# EAGLE design Untitled - halv-xs-V3.4 (EAGLE 9.0.0)
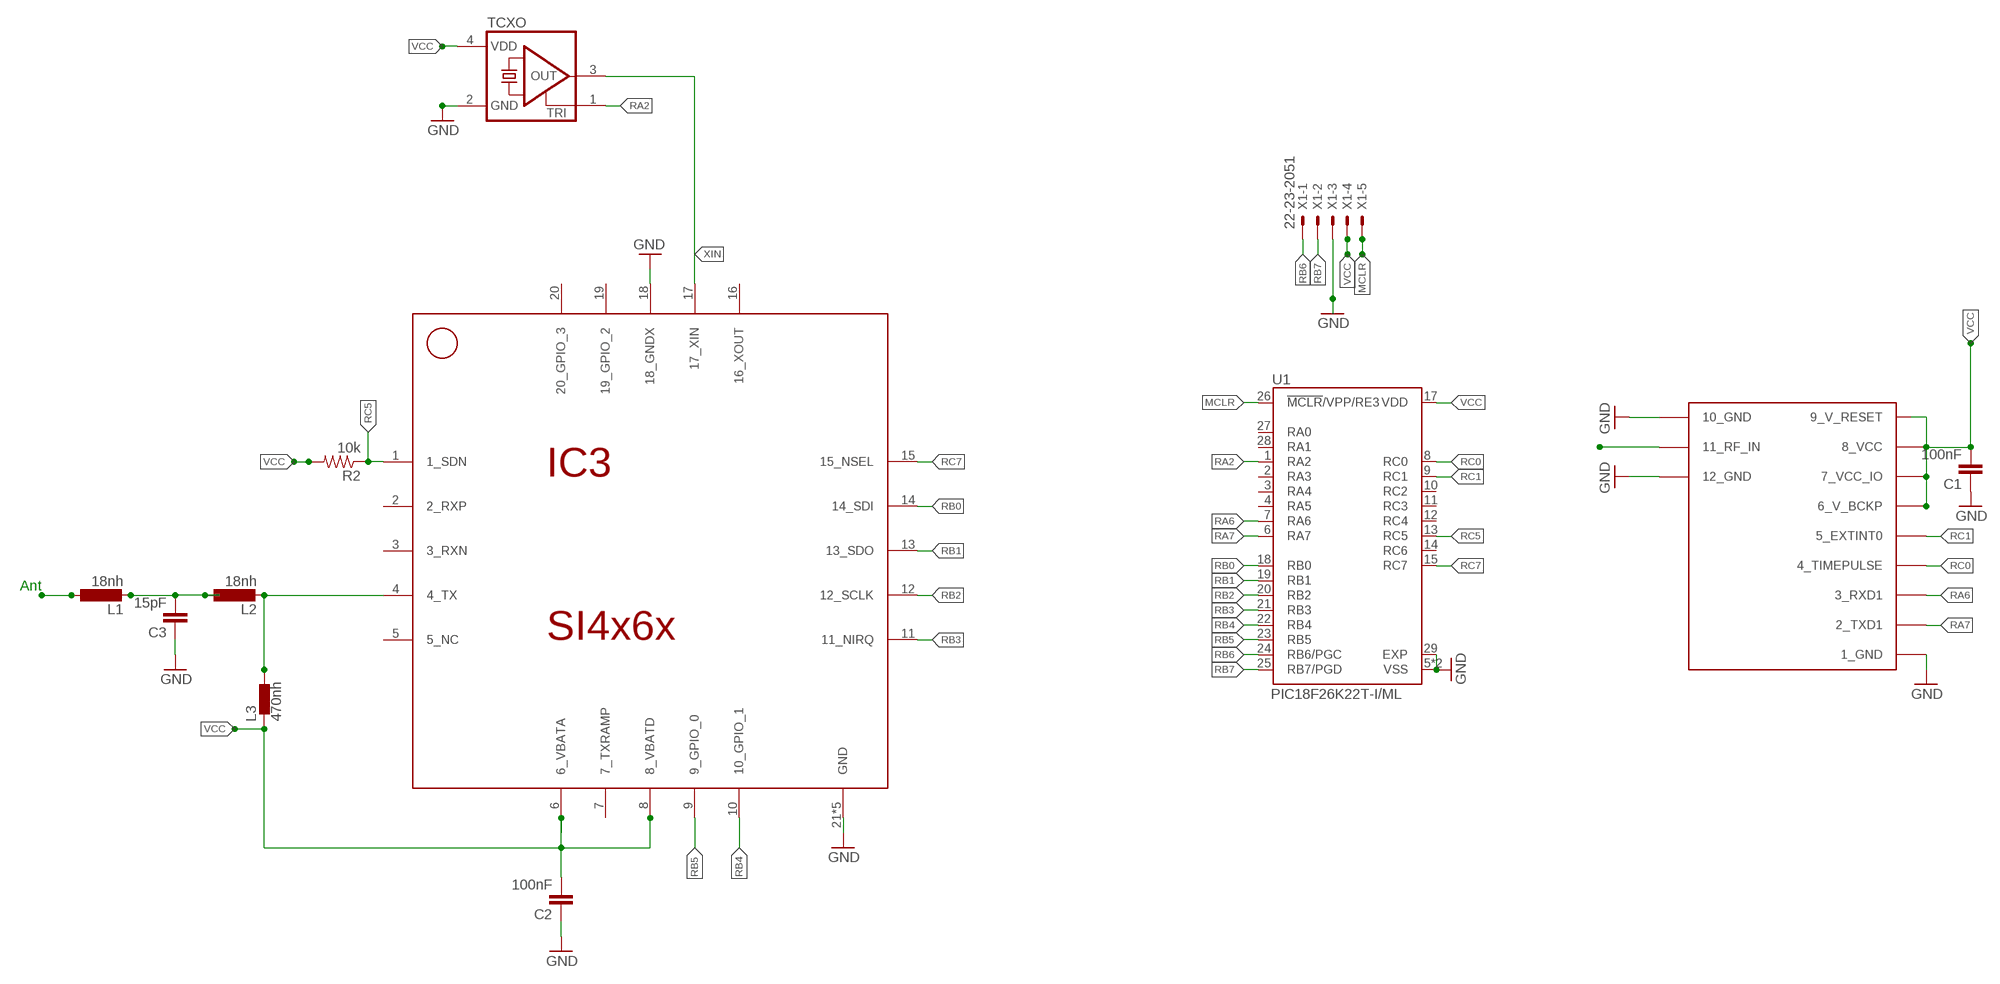
[diagram p0: schematic, sheet 1]

## Parts
C1  100nF  C-EUC0402  [C0402]
C2  100nF  C-EUC0402  [C0402]
C3  15pF  C-EUC0402  [C0402]
IC3  SI4x6x  SI4463/4  [QFN-20]
L1  18nh  L-EUL2012C  [L2012C]
L2  18nh  L-EUL2012C  [L2012C]
L3  470nh  BLM15HD601SN1  [0402]
R2  10k  R-US_R0402  [R0402]
TCXO  CRYSTAL_3.2X2.5-TCXO  [CRYSTAL_3.2X2.5-TCXO]
U1  PIC18F26K22T-I/ML  [QFN65P600X600X100-29N]
U$1  UBLOX_MAX  [UBLOX_MAX]
X1  22-23-2051  [22-23-2051]

## Nets
ANT: U$1.11_RF_IN
GND: C1.1 C2.1 C3.1 IC3.18(18_GNDX) IC3.21(GND) IC3.22(GND) IC3.23(GND) IC3.24(GND) IC3.25(GND) TCXO.2(GND) U1.5(VSS) U1.16(VSS) U1.29(EXP) U$1.1_GND U$1.10_GND U$1.12_GND X1.3
MCLR: U1.26(!MCLR!/VPP/RE3) X1.5
N$1: C3.2 L1.2 L2.1
N$17: L1.1
RA2: TCXO.1(TRI) U1.1(RA2)
RA6: U1.7(RA6) U$1.3_RXD1
RA7: U1.6(RA7) U$1.2_TXD1
RB0: IC3.14(14_SDI) U1.18(RB0)
RB1: IC3.13(13_SDO) U1.19(RB1)
RB2: IC3.12(12_SCLK) U1.20(RB2)
RB3: IC3.11(11_NIRQ) U1.21(RB3)
RB4: IC3.10(10_GPIO_1) U1.22(RB4)
RB5: IC3.9(9_GPIO_0) U1.23(RB5)
RB6: U1.24(RB6/PGC) X1.1
RB7: U1.25(RB7/PGD) X1.2
RC0: U1.8(RC0) U$1.4_TIMEPULSE
RC1: U1.9(RC1) U$1.5_EXTINT0
RC5: IC3.1(1_SDN) R2.1 U1.13(RC5)
RC7: IC3.15(15_NSEL) U1.15(RC7)
TX: IC3.4(4_TX) L2.2 L3.2
VCC: C1.2 C2.2 IC3.6(6_VBATA) IC3.8(8_VBATD) L3.1 R2.2 TCXO.4(VDD) U1.17(VDD) U$1.6_V_BCKP U$1.7_VCC_IO U$1.8_VCC U$1.9_V_RESET X1.4
XIN: IC3.17(17_XIN) TCXO.3(OUT)
Unconnected: IC3.2(2_RXP) IC3.3(3_RXN) IC3.5(5_NC) IC3.7(7_TXRAMP) IC3.16(16_XOUT) IC3.19(19_GPIO_2) IC3.20(20_GPIO_3) U1.2(RA3) U1.3(RA4) U1.4(RA5) U1.10(RC2) U1.11(RC3) U1.12(RC4) U1.14(RC6) U1.27(RA0) U1.28(RA1)

## Notes on the sheet
- Ant

## Library data of the parts
C1-C3 = rcl:C-EU: CAPACITOR, European symbol
IC3 = KT5TK:SI4463/4
L1 L2 = resistor:L-EU: INDUCTOR, European symbol
L3 = inductors:BLM15H: EMIFIL (R) Chip Ferrite Bead for GHz Noise Source: http://www.murata.com/ Ferrite Bead BLM15H.pdf
R2 = resistor:R-US_: RESISTOR, American symbol
TCXO = picoAVA-R8:CRYSTAL_3.2X2.5-TCXO
U1 = PIC18F26K22T-I_ML:PIC18F26K22T-I/ML: MCU 8-bit PIC18 PIC RISC 64KB Flash 2.5V/3.3V/5V 28-Pin QFN EP T/R; AVAILABILITY: Unavailable; DESCRIPTION: MCU 8-bit PIC18 PIC RISC 64KB Flash 2.5V/3.3V/5V 28-Pin QFN EP T/R; MF: Microchip; MP: PIC18F26K22T-I/ML; PACKAGE: QFN-28 Microchip; PRICE: None
U$1 = Max gps:UBLOX_MAX: UBLOX MAX
X1 = con-molex:22-23-2051: .100" (2.54mm) Center Header - 5 Pin; MF: MOLEX; MPN: 22-23-2051; OC_FARNELL: 1462952; OC_NEWARK: 38C9178

## Net classes
0 default: width 0.203 mm
1 vcc: width 0.254 mm

## Board
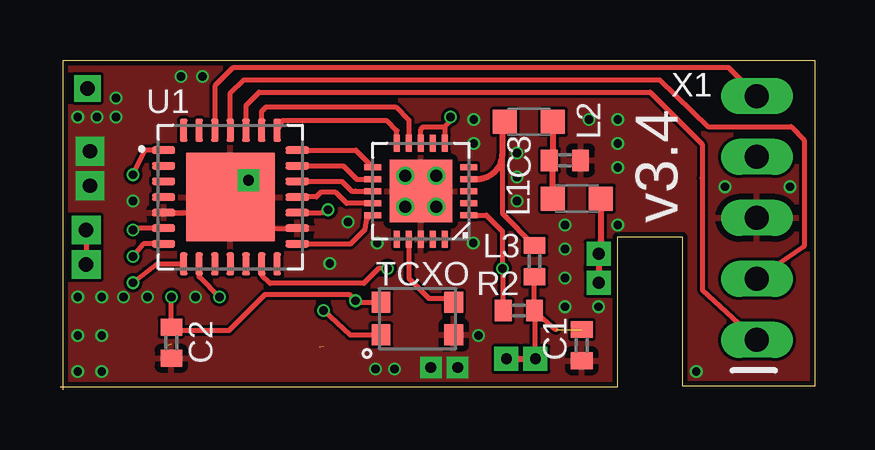
[diagram p1: board, top side]
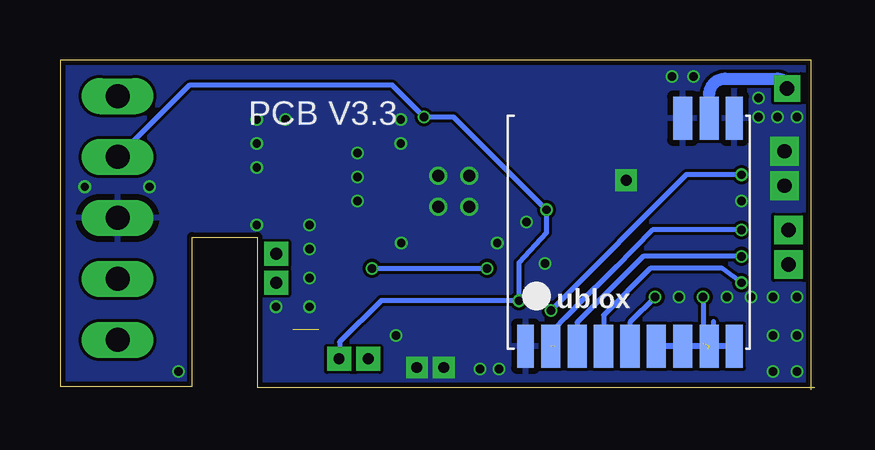
[diagram p2: board, bottom side, seen from below]

Size 31.44 x 13.74 mm. Coordinates in mm from the lower left corner, seen from the top.
Outline: 0,0.11 23.22,0.11 23.22,6.36 25.94,6.36 25.94,0.14 31.44,0.14 31.44,13.74 0.14,13.74 0.14,0
Copper layers (1*16): Top 0.035559375mm / dielectric 1.6mm / Bottom 0.035559375mm
Design rules "jlcpcb2layer *": minimum track width 5mil, minimum drill 12mil, track to track 5mil, track to pad 5mil, pad to pad 5mil, via to via 5mil, smd to smd 5mil, copper to edge 8mil, drill to drill 6mil, minimum pad ring 5mil, minimum via ring 3mil, stop-mask expansion 2.5mil, vias tented up to drill 14mil, thermal gap 10mil

### Footprints (pad centres in the part's own frame; a part is rotated, then mirrored left to right if it is on the bottom)
C0402 = smd 0.7 x 0.9: 1 -0.65,0; 2 0.65,0
QFN-20 = smd 0.7 x 0.25: 1 -2,1; 2 -2,0.5; 3 -2,0; 4 -2,-0.5; 5 -2,-1; 11 2,-1; 12 2,-0.5; 13 2,0; 14 2,0.5; 15 2,1 | smd 0.25 x 0.7: 6 -1,-2; 7 -0.5,-2; 8 0,-2; 9 0.5,-2; 10 1,-2; 16 1,2; 17 0.5,2; 18 0,2; 19 -0.5,2; 20 -1,2 | smd 2.6 x 2.6: 21 0,0 | drill 0.5: 22 -0.65,0.65; 23 0.65,0.65; 24 0.65,-0.65; 25 -0.65,-0.65
L2012C = smd 1 x 1: 1 -1,0; 2 1,0
0402 = smd 0.7 x 0.9: 1 -0.65,0; 2 0.65,0
R0402 = smd 0.7 x 0.9: 1 -0.65,0; 2 0.65,0
CRYSTAL_3.2X2.5-TCXO = smd 0.78 x 0.87: 1 -1.515,-0.68; 2 1.515,-0.68; 3 1.515,0.68; 4 -1.515,0.68
QFN65P600X600X100-29N = smd 0.96 x 0.31: 1 -2.785,1.95; 2 -2.785,1.3; 3 -2.785,0.65; 4 -2.785,0; 5 -2.785,-0.65; 6 -2.785,-1.3; 7 -2.785,-1.95; 15 2.785,-1.95; 16 2.785,-1.3; 17 2.785,-0.65; 18 2.785,0; 19 2.785,0.65; 20 2.785,1.3; 21 2.785,1.95 | smd 0.31 x 0.96: 8 -1.95,-2.785; 9 -1.3,-2.785; 10 -0.65,-2.785; 11 0,-2.785; 12 0.65,-2.785; 13 1.3,-2.785; 14 1.95,-2.785; 22 1.95,2.785; 23 1.3,2.785; 24 0.65,2.785; 25 0,2.785; 26 -0.65,2.785; 27 -1.3,2.785; 28 -1.95,2.785 | smd 3.7 x 3.7: 29 0,0
UBLOX_MAX = smd 1.8 x 0.7: 1_GND 4.95,-4.4; 9_V_RESET 4.95,4.3; 10_GND -4.55,4.3 | smd 1.8 x 0.8: 2_TXD1 4.95,-3.35; 3_RXD1 4.95,-2.25; 4_TIMEPULSE 4.95,-1.15; 5_EXTINT0 4.95,-0.05; 6_V_BCKP 4.95,1.05; 7_VCC_IO 4.95,2.15; 8_VCC 4.95,3.25; 11_RF_IN -4.55,3.25; 12_GND -4.55,2.15
22-23-2051 = drill 1 long: 1 -5.08,0; 2 -2.54,0; 3 0,0; 4 2.54,0; 5 5.08,0

### Placement (x,y rotation side)
C1  21.74,1.86 90 top
C2  4.64,1.96 90 top
C3  21.04,9.56 180 top
IC3  15.03,8.27 180 top
L1  21.54,7.96 180 top
L2  19.54,11.16 180 top
L3  19.77,5.36 90 top
R2  19.12,3.3 0 top
TCXO  14.89,2.97 0 top
U1  7.1,8.03 0 top
U$1  7.64,6.76 270 bottom
X1  29.04,7.16 90 top

### Tracks (layer width: path | path; a pad name or v marks a point on that pad's centre or on a via)
ANT  (via drill 0.6 pad 1.1)
  Bottom 0.21: U$1.11_RF_IN 4.39,12.31
  Bottom 0.508: 4.39,12.31 arc90 3.74,12.96 1.54,12.96 arc90 v1.14,12.56
GND  (via drill 0.35, 0.45 pad 0.9, 0.6 pad 1.2)
  Top 0.21: 7.17,8.1 U1.29 7.08,8.02 6.46,7.38 4.66,7.38 4.54,7.42 U1.5 | 8.27,6.72 9.73,6.72 | 9.73,6.72 10.07,6.72 | 9.73,6.72 9.73,6.7 U1.16
  other vias: 1.25,9.94 1.25,8.5 17.22,6.12 22.04,11.26 23.24,6.86 23.24,9.26 23.24,10.26 17.24,10.26 23.24,11.26 27.71,8.46 21.04,3.46 12,6.99 3.04,7.86 17.44,2.26 0.74,11.36 1.54,11.36 2.34,11.36 16.57,0.93 15.45,0.93 0.74,3.86 13.94,0.86 1.74,3.86 21.04,4.66 21.04,5.86 21.04,6.86 17.24,11.26 19.04,9.86 19.04,8.86 19.04,7.86 22.44,3.46 13.14,0.86 7.85,8.73 5.94,13.06 30.41,8.46 26.51,0.76 2.64,3.86 3.64,3.86 5.64,3.86 2.34,12.16 5.04,13.06 13.22,6.12 11.24,5.26 1.74,0.76 0.74,0.76 0.74,2.26 1.74,2.26
  pour Bottom: -4.06,15.22 34.24,15.22 34.24,-1.47 -4.06,-1.54
  pour Top: -4.07,15.22 34.23,15.22 34.24,-1.44 -4.06,-1.54
MCLR
  Top 0.21: X1.5 27.87,13.41 7.2,13.41 6.45,12.66 U1.26
N$1
  Top 0.21: 20.54,9.61 C3.2
  Top 0.254: L2.1 20.54,9.61 L1.2
N$14  (via drill 0.6 pad 1.2)
  Top 0.21: v1.09,6.66 v1.09,5.22
N$17  (via drill 0.5 pad 1)
  Top 0.21: 22.54,6.06 v22.44,5.66
  Top 0.254: v22.44,5.66 v22.44,4.46 | L1.1 22.54,6.06
RA2  (via drill 0.35)
  Top 0.21: v10.98,3.31 12.09,2.29 TCXO.1 | U1.1 3.53,9.98 v3.04,8.96
  Bottom 0.21: v3.04,8.96 5.34,8.96 v10.98,3.31
RA6  (via drill 0.35)
  Top 0.21: U1.7 3.47,6.08 v3.04,5.56
  Bottom 0.21: v3.04,5.56 7.14,5.56 9.89,2.81 U$1.3_RXD1
RA7  (via drill 0.35)  (1 unrouted)
  Top 0.21: U1.6 3.25,6.73 v3.04,6.66
  Bottom 0.21: v3.04,6.66 6.76,6.66 8.29,5.11 9.97,3.43 9.97,3.42 10.39,3 10.4,3 10.83,2.57 10.83,1.79
RB0
  Top 0.21: IC3.14 13,7.77 11.94,7.77 11.48,8.22 10.86,8.22 10.68,8.04 U1.18
RB1
  Top 0.21: U1.19 11.74,8.68 12.15,8.27 12.31,8.27 12.38,8.27 IC3.13
RB2
  Top 0.21: U1.20 11.81,9.33 12.37,8.77 IC3.12
RB3
  Top 0.21: U1.21 12.33,9.98 IC3.11
RB4
  Top 0.21: IC3.10 14.03,10.8 13.63,11.2 9.23,11.2 U1.22
RB5
  Top 0.21: U1.23 8.4,11.6 8.59,11.79 13.98,11.79 14.53,11.24 IC3.9
RB6
  Top 0.21: U1.24 7.75,11.85 8.3,12.4 24.59,12.4 26.76,10.22 26.76,8.83 26.76,8.77 26.76,4.16 X1.1
RB7
  Top 0.21: U1.25 7.1,12.38 7.65,12.91 25,12.91 27,10.96 30.46,10.96 31,10.39 31,5.97 X1.2
RC0  (via drill 0.35)
  Top 0.21: v3.04,4.46 4.05,5.25 U1.8
  Bottom 0.21: v3.04,4.46 3.84,5.06 6.84,5.06 8.79,3.11 U$1.4_TIMEPULSE
RC1  (via drill 0.35)
  Top 0.21: 5.8,5.13 U1.9 5.8,4.7 v6.64,3.86
  Bottom 0.21: v6.64,3.86 7.69,2.81 U$1.5_EXTINT0
RC5  (via drill 0.35)
  Top 0.21: R2.1 18.47,4.99 | 18.47,4.99 v18.44,5.06 | IC3.1 17.77,7.27 18.43,6.61 18.43,5.03 18.47,4.99 | 8.38,4.95 8.41,4.89 | 8.41,4.89 U1.13 | v13.64,5.06 13.29,5.06 12.66,4.43 8.75,4.43 8.74,4.43 8.41,4.76 8.41,4.89
  Bottom 0.21: v18.44,5.06 v13.64,5.06
RC7
  Top 0.21: IC3.15 12.94,7.27 12.78,7.1 12.72,6.69 12.11,6.08 U1.15
TX
  Top 0.21: IC3.4 17.35,8.77 | 18.44,11.06 arc-90 L2.2 | L3.2 18.44,7.34 18.44,9.86
  Top 0.254: 17.35,8.77 arc90 18.44,9.86 18.44,11.06
VCC  (via drill 0.35, 0.45 pad 1)  (3 unrouted)
  Top 0.21: v19.81,1.29 19.81,3.46 R2.2 | R2.2 L3.1 | v16.27,11.36 16.44,11.36 16.03,10.95 | 16.03,10.95 IC3.6 | IC3.8 15.03,10.85 15.13,10.95 15.8,10.95 | 15.8,10.95 16.03,10.95 | U1.17 10.89,7.38 v11.18,7.5 | 13.47,3.78 TCXO.4 12.52,3.64 v12.32,3.71 12.07,3.96 8.54,3.96 7.04,2.46 4.79,2.46 C2.2 v4.64,3.86 | 19.81,1.63 v19.81,1.29 | v19.81,1.29 18.27,1.29 | 15.8,10.95 | R2.2 19.6,3.3 | R2.2 20.66,2.51
  Top 0.254: v18.6,1.29 v19.81,1.29
  Bottom 0.21: v19.81,1.29 19.79,1.99 18.06,3.71 v12.32,3.71 12.32,5.3 11.18,6.55 v11.18,7.5 15.04,11.36 v16.27,11.36 17.56,12.65 17.56,12.68 26.06,12.68 X1.4 | 4.22,2.84 4.22,1.93 4.44,1.71 | v4.64,3.86 4.64,1.91
  Bottom 0.254: U$1.9_V_RESET U$1.8_VCC U$1.7_VCC_IO U$1.6_V_BCKP
XIN
  Top 0.21: IC3.17 14.53,4.64 15.36,3.81 16.37,3.81 TCXO.3

### Text on the board
tNames: . | v3.4
bNames: PCB V3.3